# EAGLE schematic CustomPower (EAGLE 8.6.0)
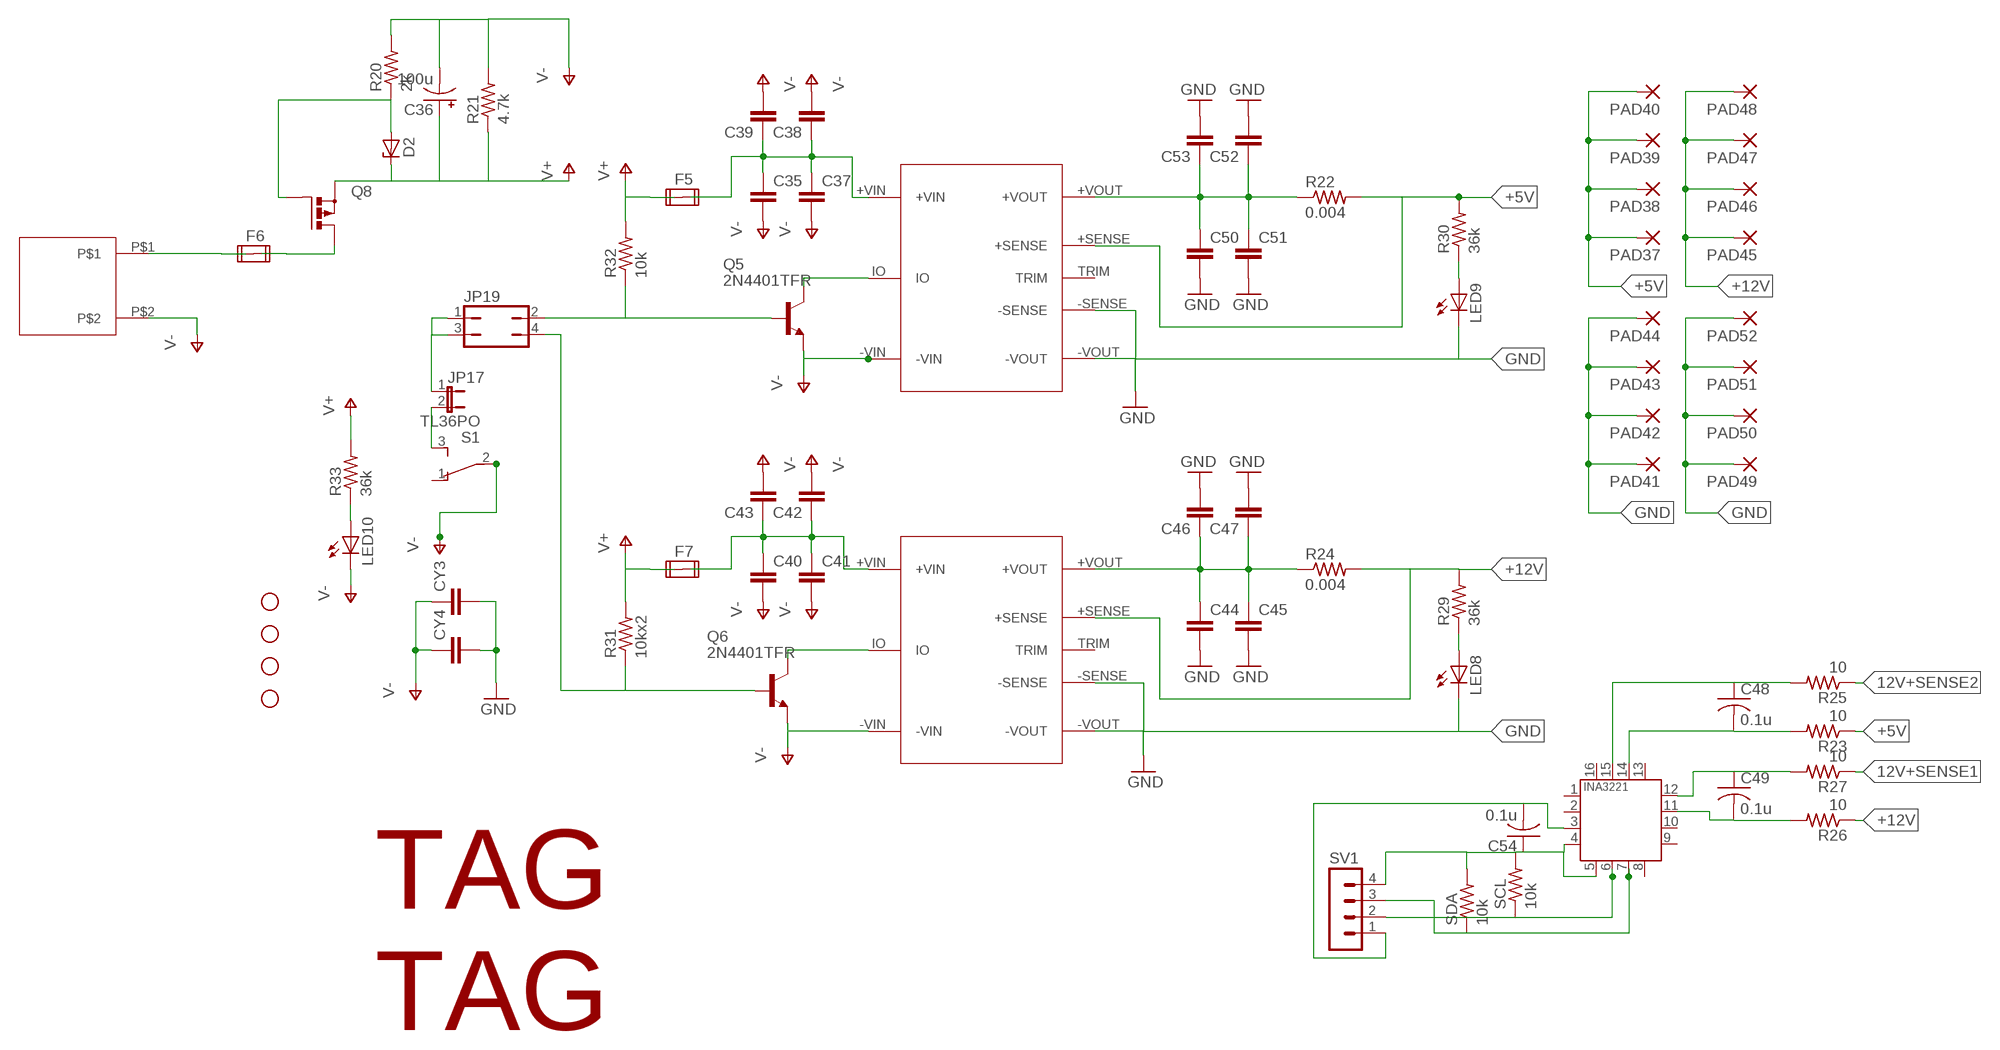
[diagram p0: schematic, sheet 1]

## Parts
C35  C-EU050-035X075  [C050-035X075]
C36  100u  CPOL-USE3.5-8  [E3,5-8]
C37  C-EU050-035X075  [C050-035X075]
C38  C-EU050-035X075  [C050-035X075]
C39  C-EU050-035X075  [C050-035X075]
C40  C-EU050-035X075  [C050-035X075]
C41  C-EU050-035X075  [C050-035X075]
C42  C-EU050-035X075  [C050-035X075]
C43  C-EU050-035X075  [C050-035X075]
C44  C-EU025-040X050  [C025-040X050]
C45  C-EU025-040X050  [C025-040X050]
C46  C-EU025-040X050  [C025-040X050]
C47  C-EU025-040X050  [C025-040X050]
C48  0.1u  C-USC0805K  [C0805K]
C49  0.1u  C-USC0805K  [C0805K]
C50  C-EU025-040X050  [C025-040X050]
C51  C-EU025-040X050  [C025-040X050]
C52  C-EU025-040X050  [C025-040X050]
C53  C-EU025-040X050  [C025-040X050]
C54  0.1u  C-USC0805K  [C0805K]
CY3  CYYC7B5  [YC7B5]
CY4  CYYC7B5  [YC7B5]
D2  BZV10  [DO34Z7]
F5  FUSE2P  [FUSE1]
F6  FUSE2P  [FUSE1]
F7  FUSE2P  [FUSE1]
JP3  STAND-OFF  [STAND-OFF]
JP4  STAND-OFF  [STAND-OFF]
JP5  STAND-OFF  [STAND-OFF]
JP6  STAND-OFF  [STAND-OFF]
JP17  JP1E  [JP1]
JP19  JP2Q  [JP2Q]
LED8  LEDSMT1206  [1206]
LED9  LEDSMT1206  [1206]
LED10  LEDSMT1206  [1206]
PAD37  WIREPAD3,17/1,3  [3,17/1,3]
PAD38  WIREPAD3,17/1,3  [3,17/1,3]
PAD39  WIREPAD3,17/1,3  [3,17/1,3]
PAD40  WIREPAD3,17/1,3  [3,17/1,3]
PAD41  WIREPAD3,17/1,3  [3,17/1,3]
PAD42  WIREPAD3,17/1,3  [3,17/1,3]
PAD43  WIREPAD3,17/1,3  [3,17/1,3]
PAD44  WIREPAD3,17/1,3  [3,17/1,3]
PAD45  WIREPAD3,17/1,3  [3,17/1,3]
PAD46  WIREPAD3,17/1,3  [3,17/1,3]
PAD47  WIREPAD3,17/1,3  [3,17/1,3]
PAD48  WIREPAD3,17/1,3  [3,17/1,3]
PAD49  WIREPAD3,17/1,3  [3,17/1,3]
PAD50  WIREPAD3,17/1,3  [3,17/1,3]
PAD51  WIREPAD3,17/1,3  [3,17/1,3]
PAD52  WIREPAD3,17/1,3  [3,17/1,3]
Q5  2N4401TFR  [TO92-EBC]
Q6  2N4401TFR  [TO92-EBC]
Q8  PMOSFET_PTO220BV  [TO220BV]
R20  2k  R-US_0204/7  [0204/7]
R21  4.7k  R-US_0204/7  [0204/7]
R22  0.004  R-US_0617/22  [0617/22]
R23  10  R-US_R0805  [R0805]
R24  0.004  R-US_0617/22  [0617/22]
R25  10  R-US_R0805  [R0805]
R26  10  R-US_R0805  [R0805]
R27  10  R-US_R0805  [R0805]
R29  36k  R-US_R0805  [R0805]
R30  36k  R-US_R0805  [R0805]
R31  10kx2  R-US_R0805  [R0805]
R32  10k  R-US_R0805  [R0805]
R33  36k  R-US_R0805  [R0805]
S1  TL36PO  [TL3XPO]
SCL  10k  R-US_R0805  [R0805]
SDA  10k  R-US_R0805  [R0805]
SV1  MA04-1  [MA04-1]
U3  INA3221.  [HVQFN16_4X4]
U$1  MURATA_BRICK  [MURATA_BRICK]
U$2  MURATA_BRICK  [MURATA_BRICK]
U$3  TERM_POWER  [TERM_BLOCK_POWER]
U$4  TAG  [TAG]
U$5  TAG  [TAG]

## Nets
12V+SENSE1: C44.1 C45.1 C46.1 C47.1 R24.1 R27.1 U$2.+VOUT
12V+SENSE2: C50.1 C51.1 C52.1 C53.1 R22.1 R25.1 U$1.+VOUT
+5V: PAD37.1(P) PAD38.1(P) PAD39.1(P) PAD40.1(P) R22.2 R23.1 R30.2 U$1.+SENSE
+12V: PAD45.1(P) PAD46.1(P) PAD47.1(P) PAD48.1(P) R24.2 R26.1 R29.2 U$2.+SENSE
GND [ouputGroundPlane]: C44.2 C45.2 C46.2 C47.2 C50.2 C51.2 C52.2 C53.2 CY3.2 CY4.2 LED8.C LED9.C PAD41.1(P) PAD42.1(P) PAD43.1(P) PAD44.1(P) PAD49.1(P) PAD50.1(P) PAD51.1(P) PAD52.1(P) U$1.-SENSE U$1.-VOUT U$2.-SENSE U$2.-VOUT
N$6: F6.2A F6.2B Q8.D
N$13: C35.1 C37.1 C38.1 C39.1 F5.2A F5.2B U$1.+VIN
N$14: F6.1A F6.1B U$3.P$1
N$15: LED10.A R33.1
N$16: C40.1 C41.1 C42.1 C43.1 F7.2A F7.2B U$2.+VIN
N$17: D2.A Q8.G R20.1
N$18: Q5.C U$1.IO
N$19: Q6.C U$2.IO
N$20: SCL.1 SV1.2 U3.6(SCL)
N$21: C48.1 R25.2 U3.15(IN+2)
N$22: C48.2 R23.2 U3.14(IN-2)
N$23: JP19.4 Q6.B R31.1
N$24: JP19.2 Q5.B R32.1
N$25: JP17.1 JP19.1 JP19.3
N$27: JP17.2 S1.3(S)
N$28: C49.1 R27.2 U3.12(IN+1)
N$29: LED9.A R30.1
N$30: LED8.A R29.1
N$31: C49.2 R26.2 U3.11(IN-1)
N$32: SDA.1 SV1.3 U3.7(SDA)
N$33: C54.2 SV1.1 U3.3(GND)
N$34: C54.1 SCL.2 SDA.2 SV1.4 U3.4(VS) U3.5(A0)
V+: C36.+ D2.C F5.1A F5.1B F7.1A F7.1B Q8.S R21.1 R31.2 R32.2 R33.2
V- [ouputGroundPlane]: C35.2 C36.- C37.2 C38.2 C39.2 C40.2 C41.2 C42.2 C43.2 CY3.1 CY4.1 LED10.C Q5.E Q6.E R20.2 R21.2 S1.2(P) U$1.-VIN U$2.-VIN U$3.P$2
Unconnected: S1.1(O) U3.1(IN-3) U3.2(IN+3) U3.8(WARNING) U3.9(CRITICAL) U3.10(PV) U3.13(TC) U3.16(VPU) U$1.TRIM U$2.TRIM

## Library data of the parts
C35 C37-C47 C50-C53 = rcl:C-EU: CAPACITOR, European symbol
C36 = rcl:CPOL-US: POLARIZED CAPACITOR, American symbol; SPICEPREFIX: C
C48 C49 C54 = rcl:C-US: CAPACITOR, American symbol; SPICEPREFIX: C
CY3 CY4 = rcl:CY: Y CAPACITOR for power line
D2 = diode:BZV10: Z DIODE
F5 F7 = special:FUSE2P: FUSE 5 x 20 mm
F6 = special:FUSE2P: FUSE 5 x 20 mm; SPICEPREFIX: E
JP3-JP6 = SparkFun:STAND-OFF: Stand Off This is the mechanical footprint for a #4 phillips button head screw. Use the keepout ring to avoid running the screw head into surrounding components. SKU : PRT-00447
JP17 = jumper:JP1E: JUMPER
JP19 = jumper:JP2Q: JUMPER
LED8-LED10 = led:LED: LED OSRAM: - CHIPLED LG R971, LG N971, LY N971, LG Q971, LY Q971, LO R971, LY R971 LH N974, LH R974 LS Q976, LO Q976, LY Q976 LO Q996 - Hyper CHIPLED LW Q18S LB Q993, LB Q99A, LB R99A - SideLED LS A670, LO A670, LY A670, LG A670, LP A670 LB A673, LV A673, LT A673, LW A673 LH A674 LY A675 LS A676, LA A676, LO A676, LY A676, LW A676 LS A679, LY A679, LG A679 - Hyper Micro SIDELED® LS Y876, LA Y876, LO Y876, LY Y876 LT Y87S - SmartLED LW L88C, LW L88S LB L89C, LB L89S, LG L890 LS L89K, LO L89K, LY L89K LS L896, LA L896, LO L896, LY L896 - TOPLED LS T670, LO T670, LY T670, LG T670, LP T670 LSG T670, LSP T670, LSY T670, LOP T670, LYG T670 LG T671, LOG T671, LSG T671 LB T673, LV T673, LT T673, LW T673 LH T674 LS T676, LA T676, LO T676, LY T676, LB T676, LH T676, LSB T676, LW T676 LB T67C, LV T67C, LT T67C, LS T67K, LO T67K, LY T67K, LW E67C LS E67B, LA E67B, LO E67B, LY E67B, LB E67C, LV E67C, LT E67C LW T67C LS T679, LY T679, LG T679 LS T770, LO T770, LY T770, LG T770, LP T770 LB T773, LV T773, LT T773, LW T773 LH T774 LS E675, LA E675, LY E675, LS T675 LS T776, LA T776, LO T776, LY T776, LB T776 LHGB T686 LT T68C, LB T68C - Hyper Mini TOPLED® LB M676 - Mini TOPLED Santana® LG M470 LS M47K, LO M47K, LY M47K Source: http://www.osram.convergy.de LUXEON: - LUMILED® LXK2-PW12-R00, LXK2-PW12-S00, LXK2-PW14-U00, LXK2-PW14-V00 LXK2-PM12-R00, LXK2-PM12-S00, LXK2-PM14-U00 LXK2-PE12-Q00, LXK2-PE12-R00, LXK2-PE12-S00, LXK2-PE14-T00, LXK2-PE14-U00 LXK2-PB12-K00, LXK2-PB12-L00, LXK2-PB12-M00, LXK2-PB14-N00, LXK2-PB14-P00, LXK2-PB14-Q00 LXK2-PR12-L00, LXK2-PR12-M00, LXK2-PR14-Q00, LXK2-PR14-R00 LXK2-PD12-Q00, LXK2-PD12-R00, LXK2-PD12-S00 LXK2-PH12-R00, LXK2-PH12-S00 LXK2-PL12-P00, LXK2-PL12-Q00, LXK2-PL12-R00 Source: www.luxeon.com KINGBRIGHT: KA-3528ASYC Source: www.kingbright.com
PAD37-PAD52 = wirepad:WIREPAD: Wire PAD connect wire on PCB
Q5 Q6 = New Power Board Library:2N4401TFR: NPN Transistor
Q8 = transistor-power:PMOSFET_P: Power MOSFET P-Channel
R20 R21 R23 R25-R27 R29-R33 SCL SDA = resistor:R-US_: RESISTOR, American symbol
R22 R24 = rcl:R-US_: RESISTOR, American symbol
S1 = switch:TL36PO: TINY SWITCH ON - ON Source: http://www2.produktinfo.conrad.com/datenblaetter/700000-724999/705152-da-01-de-Subminiaturschalter_TL_36YO.pdf
SV1 = con-lstb:MA04-1: PIN HEADER; OC_FARNELL: unknown; OC_NEWARK: unknown
U3 = New Power Board Library:INA3221: The INA3221 is a three-channel, high-side current and bus voltage monitor with an I 2C- and SMBUScompatible interface. The INA3221 monitors both shunt voltage drops and bus supply voltages, in addition to having programmable conversion times and averaging modes for these signals. The INA3221 offers both critical and warning alerts to detect multiple programmable out-of-range conditions for each channel.
U$1 U$2 = Murata_Brick:MURATA_BRICK
U$3 = TERM_POWER:TERM_POWER
U$4 U$5 = TAG:TAG

## Net classes
1 ouputGroundPlane: clearance 0.205 mm to class 0, clearance 1 mm
2 inputGroundPlane: clearance 0.205 mm to class 1